# Altium schematic sheet Sheet5.SchDoc
size A3; SPICEModelCacheJPNMEEMH: <root> / <DocumentId>JPNMEEMH</DocumentId> / <CacheFrame Number="0"> / <Model Name="zener" Kind="MDL"> / <Text>*ZENER / *Default Zener 10V @ 10mA / *Zener Diode Pinout: A,K / .MODEL ZENER D( BV=10 IBV=10E-3 )</Text> / </Model> / <Model Name="led0" Kind="MDL"> / <Text>*Typ INFRARED GaAs LED: Vf=1.2V Vr=5V If=40mA trr=3uS / *LED Pinout: 1=A, 2=K / .MODEL LED0 D (IS=93.5P RS=84M N=2.63 BV=5 IBV=10U / + CJO=2.97P VJ=.75 M=.333 TT=4.32U)</Text> / </Model> / </CacheFrame> / </root>
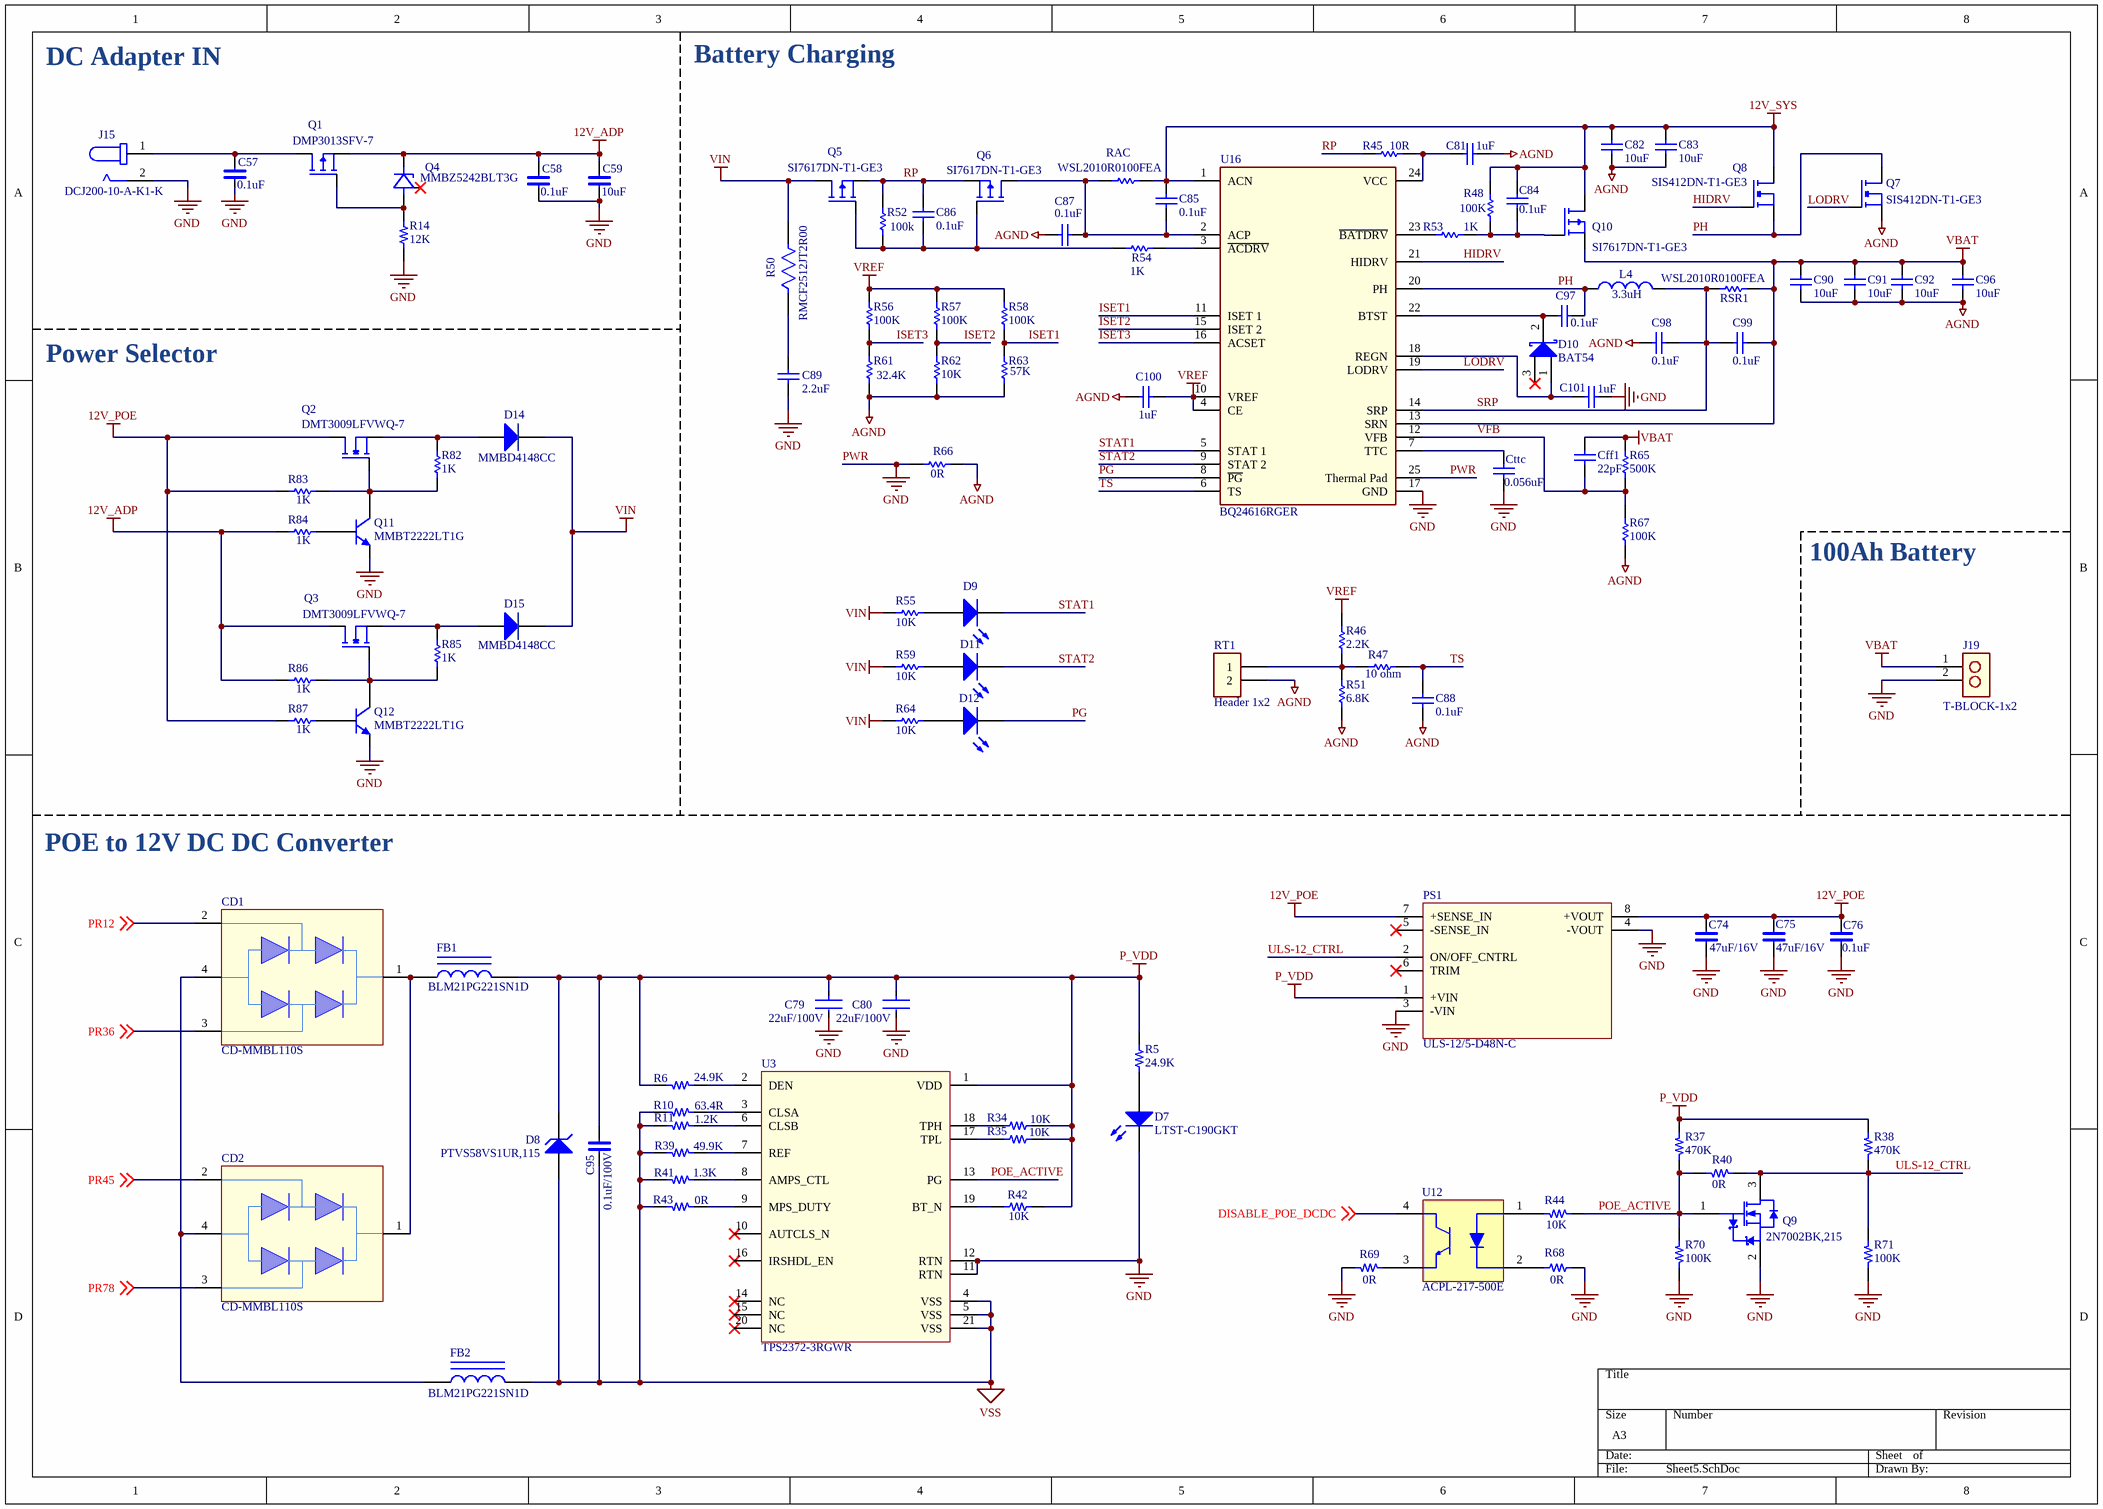
[diagram p0: Sheet5.SchDoc]

## Parts
C57  0.1uF  [C-0603/1608]
C58  0.1uF  [C-0603/1608]
C59  10uF  [C-1206/3216]
C74  47uF/16V  [C-1206/3216]
C75  47uF/16V  [C-1206/3216]
C76  0.1uF  [C-0402/1005]
C79  22uF/100V  [FP-KRM55W-6_1_5_3_6_7_1_2-MFG]
C80  22uF/100V  [FP-KRM55W-6_1_5_3_6_7_1_2-MFG]
C81  value 1uF  [C-0603/1608]  (hidden comment: Capacitor)
C82  value 10uF  [C-0805/2012]  (hidden comment: Capacitor)
C83  value 10uF  [C-0805/2012]  (hidden comment: Capacitor)
C84  value 0.1uF  [R-0402/1005]  (hidden comment: Capacitor)
C85  value 0.1uF  [C-0402/1005]  (hidden comment: Capacitor)
C86  value 0.1uF  [C-0402/1005]  (hidden comment: Capacitor)
C87  value 0.1uF  [C-0402/1005]  (hidden comment: Capacitor)
C88  value 0.1uF  [C-0402/1005]  (hidden comment: Capacitor)
C89  value 2.2uF  [C1206]  (hidden comment: Capacitor)
C90  value 10uF  [C-0805/2012]  (hidden comment: Capacitor)
C91  value 10uF  [C-0805/2012]  (hidden comment: Capacitor)
C92  value 10uF  [C-0805/2012]  (hidden comment: Capacitor)
C95  0.1uF/100V  [C-0402/1005]
C96  value 10uF  [C-0805/2012]  (hidden comment: Capacitor)
C97  value 0.1uF  [C-0402/1005]  (hidden comment: Capacitor)
C98  value 0.1uF  [C-0402/1005]  (hidden comment: Capacitor)
C99  value 0.1uF  [C-0402/1005]  (hidden comment: Capacitor)
C100  value 1uF  [C-0603/1608]  (hidden comment: Capacitor)
C101  value 1uF  [C-0603/1608]  (hidden comment: Capacitor)
CD1  CD-MMBL110S  [CD-MMBL110S]  (value not drawn)
CD2  CD-MMBL110S  [CD-MMBL110S]  (value not drawn)
Cff1  value 22pF  [C-0402/1005]  (hidden comment: Capacitor)
Cttc  value 0.056uF  [C-1206/3216]  (hidden comment: Capacitor)
D7  LTST-C190GKT  [LEDC1608X35N]
D8  PTVS58VS1UR,115  [DIO_PMEG4030ER,115]
D9  LED  [LED-0402-GREEN]  (value not drawn)
D10  BAT54  [SOT-23-3]
D11  LED  [LED-0402-GREEN]  (value not drawn)
D12  LED  [LED-0402-GREEN]  (value not drawn)
D14  MMBD4148CC  [SOT-23-3]
D15  MMBD4148CC  [SOT-23-3]
FB1  BLM21PG221SN1D  [BEADC2012X105N]
FB2  BLM21PG221SN1D  [BEADC2012X105N]
J15  DCJ200-10-A-K1-K  [GCT_DCJ200-10-A-XX-X_REVA]
J19  T-BLOCK-1x2  [Terminal Block-1x2-5.08mm]
L4  value 3.3uH  [IND_SRN6045TA-3R3Y]  (hidden comment: Inductor)
PS1  ULS-12/5-D48N-C  [CONV_ULS-12/5-D48N-C]
Q1  DMP3013SFV-7  [POWERDI3333-8_UX_DIO]
Q2  DMT3009LFVWQ-7  [POWERDI3333-8_UX_DIO]
Q3  DMT3009LFVWQ-7  [POWERDI3333-8_UX_DIO]
Q4  MMBZ5242BLT3G  [SOT-23-3]
Q5  SI7617DN-T1-GE3  [POWERDI3333-8_UX_DIO]
Q6  SI7617DN-T1-GE3  [POWERDI3333-8_UX_DIO]
Q7  SIS412DN-T1-GE3  [POWERDI3333-8_UX_DIO]
Q8  SIS412DN-T1-GE3  [POWERDI3333-8_UX_DIO]
Q9  2N7002BK,215  [NXP-SOT23_M]
Q10  SI7617DN-T1-GE3  [POWERDI3333-8_UX_DIO]
Q11  MMBT2222LT1G  [SOT-23-3]
Q12  MMBT2222LT1G  [SOT-23-3]
R5  24.9K  [R-0402/1005]
R6  24.9K  [R-0402/1005]
R10  63.4R  [R-0402/1005]
R11  1.2K  [R-0402/1005]
R14  12K  [R-0402/1005]
R34  10K  [R-0402/1005]
R35  10K  [R-0402/1005]
R37  470K  [R-0402/1005]
R38  470K  [R-0402/1005]
R39  49.9K  [R-0402/1005]
R40  0R  [R-0402/1005]
R41  1.3K  [R-0402/1005]
R42  10K  [R-0402/1005]
R43  0R  [R-0402/1005]
R44  10K  [R-0402/1005]
R45  value 10R  [R-0805/2012]  (hidden comment: Resistor)
R46  value 2.2K  [R-0402/1005]  (hidden comment: Resistor)
R47  value 10 ohm  [R-0402/1005]  (hidden comment: Resistor)
R48  value 100K  [R-0402/1005]  (hidden comment: Resistor)
R50  RMCF2512JT2R00  [FP-RMCF2512-IPC_A]
R51  value 6.8K  [R-0402/1005]  (hidden comment: Resistor)
R52  value 100k  [R-0402/1005]  (hidden comment: Resistor)
R53  value 1K  [R-0402/1005]  (hidden comment: Resistor)
R54  1K  [R-0402/1005]
R55  value 10K  [R-0402/1005]  (hidden comment: Resistor)
R56  value 100K  [R-0402/1005]  (hidden comment: Resistor)
R57  value 100K  [R-0402/1005]  (hidden comment: Resistor)
R58  value 100K  [R-0402/1005]  (hidden comment: Resistor)
R59  value 10K  [R-0402/1005]  (hidden comment: Resistor)
R61  value 32.4K  [R-0402/1005]  (hidden comment: Resistor)
R62  value 10K  [R-0402/1005]  (hidden comment: Resistor)
R63  value 57K  [R-0402/1005]  (hidden comment: Resistor)
R64  value 10K  [R-0402/1005]  (hidden comment: Resistor)
R65  value 500K  [R-0402/1005]  (hidden comment: Resistor)
R66  value 0R  [R-1210]  (hidden comment: Resistor)
R67  value 100K  [R-0402/1005]  (hidden comment: Resistor)
R68  0R  [R-0402/1005]
R69  0R  [R-0402/1005]
R70  100K  [R-0402/1005]
R71  100K  [R-0402/1005]
R82  1K  [R-0402/1005]
R83  1K  [R-0402/1005]
R84  1K  [R-0402/1005]
R85  1K  [R-0402/1005]
R86  1K  [R-0402/1005]
R87  1K  [R-0402/1005]
RAC  WSL2010R0100FEA  [RESC5125X89X51LL25T25]
RSR1  WSL2010R0100FEA  [RESC5125X89X51LL25T25]
RT1  Header 1x2  [PIN HEADER 1x2 2.54mm]
U3  TPS2372-3RGWR  [QFN65P500X500X100-21N]
U12  ACPL-217-500E  [AVAG-ACPL-217-4_M]
U16  BQ24616RGER  [QFN50P400X400X100-25N]

## Nets
12V_ADP: C58.1 C59.1 Q1.S Q3.D Q4.3 R84.1 R86.1
12V_POE: C74.1 C75.1 C76.1 PS1.7(+SENSE_IN) PS1.8(+VOUT) Q2.D R83.1 R87.1
12V_SYS: C82.1 C83.1 C84.2 C85.2 Q8.D Q10.D R48.2 RAC.2 U16.1(ACN)
AGND: C81.2 C82.2 C83.2 C87.1 C88.1 C90.2 C91.2 C92.2 C96.2 C98.2 C100.1 Q7.S R51.2 R61.2 R62.2 R63.2 R66.1 R67.1 RT1.2
P_VDD: C79.1 C80.1 C95.1 D8.2(K) FB1.2 PS1.1(+VIN) R5.1 R6.2 R34.2 R35.2 R37.1 R38.1 R42.2 U3.1(VDD)
PWR: C57.2 C58.2 C59.2 C74.2 C75.2 C76.2 C79.2 C80.2 C89.1 C101.2 Cttc.2 D7.C J15.2 J19.2 PS1.3(-VIN) PS1.4(-VOUT) Q9.2(S) Q11.1(E) Q12.1(E) R14.1 R66.2 R68.1 R69.1 R70.2 R71.2 U3.11(RTN) U3.12(RTN) U16.17(GND) U16.25(Thermal_Pad)  [also labelled GND]
VBAT: C90.1 C91.1 C92.1 C96.1 C99.1 Cff1.2 J19.1 Q10.S R65.2 RSR1.2 U16.13(SRN)
VIN: D14.2(K) D15.2(K) Q5.D R50.2 R55.2 R59.2 R64.2
VREF: C100.2 R46.1 R56.1 R57.1 R58.1 U16.4(CE) U16.10(VREF)
VSS: C95.2 D8.1(A) FB2.2 R10.2 R11.2 R39.2 R41.2 R43.2 U3.4(VSS) U3.5(VSS) U3.21(VSS)
DISABLE_POE_DCDC: U12.4(COLLECTOR) ; off-sheet DISABLE_POE_DCDC
HIDRV: Q8.G U16.21(HIDRV)
ISET1: R58.2 R63.1 U16.11(ISET_1)
ISET2: R57.2 R62.1 U16.15(ISET_2)
ISET3: R56.2 R61.1 U16.16(ACSET)
LODRV: Q7.G U16.19(LODRV)
PG: D12.2 U16.8(~{PG})
PH: C97.1 L4.1 Q7.D Q8.S U16.20(PH)
POE_ACTIVE: Q9.1(G) R37.2 R40.1 R44.1 R70.1 U3.13(PG)
PR12: CD1.2 ; off-sheet PR12
PR36: CD1.3 ; off-sheet PR36
PR45: CD2.2 ; off-sheet PR45
PR78: CD2.3 ; off-sheet PR78
RP: C86.2 Q5.S Q6.S R45.1 R52.2
SRP: C98.1 C99.2 L4.2 RSR1.1 U16.14(SRP)
STAT1: D9.2 U16.5(STAT_1)
STAT2: D11.2 U16.9(STAT_2)
TS: C88.2 R47.1 U16.6(TS)
ULS-12_CTRL: PS1.2(ON/OFF_CNTRL) Q9.3(D) R38.2 R40.2 R71.1
VFB: Cff1.1 R65.1 R67.2 U16.12(VFB)
NetC57_1: C57.1 J15.1 Q1.D
NetC81_1: C81.1 R45.2 U16.24(VCC)
NetC84_1: C84.1 Q10.G R48.1 R53.1
NetC85_1: C85.1 C87.2 Q6.D RAC.1 U16.2(ACP)
NetC86_1: C86.1 Q5.G Q6.G R52.1 R54.1
NetC89_2: C89.2 R50.1
NetC97_2: C97.2 D10.2 U16.22(BTST)
NetC101_1: C101.1 D10.1 U16.18(REGN)
NetCD1_1: CD1.1 CD2.1 FB1.1
NetCD1_4: CD1.4 CD2.4 FB2.1
NetCttc_1: Cttc.1 U16.7(TTC)
NetD7_A: D7.A R5.2
NetD9_1: D9.1 R55.1
NetD11_1: D11.1 R59.1
NetD12_1: D12.1 R64.1
NetD14_1: D14.1(A) Q2.S R82.2
NetD15_1: D15.1(A) Q3.S R85.2
NetQ1_G: Q1.G Q4.1 R14.2
NetQ2_G: Q2.G Q11.3(C) R82.1 R83.2
NetQ3_G: Q3.G Q12.3(C) R85.1 R86.2
NetQ11_2: Q11.2(B) R84.2
NetQ12_2: Q12.2(B) R87.2
NetR6_1: R6.1 U3.2(DEN)
NetR10_1: R10.1 U3.3(CLSA)
NetR11_1: R11.1 U3.6(CLSB)
NetR34_1: R34.1 U3.18(TPH)
NetR35_1: R35.1 U3.17(TPL)
NetR39_1: R39.1 U3.7(REF)
NetR41_1: R41.1 U3.8(AMPS_CTL)
NetR42_1: R42.1 U3.19(BT_N)
NetR43_1: R43.1 U3.9(MPS_DUTY)
NetR44_2: R44.2 U12.1(ANODE)
NetR46_2: R46.2 R47.2 R51.1 RT1.1
NetR53_2: R53.2 U16.23(~{BATDRV})
NetR54_2: R54.2 U16.3(~{ACDRV})
NetR68_2: R68.2 U12.2(CATHODE)
NetR69_2: R69.2 U12.3(EMITTRE)

Not connected (* = marked no-connect by the designer): D10 3*; PS1 5(-SENSE_IN)* 6(TRIM)*; Q4 2*; U3 10(AUTCLS_N)* 14(NC)* 15(NC)* 16(IRSHDL_EN)* 20(NC)*

## Notes on the sheet
- DC Adapter IN
- Battery Charging
- Power Selector
- 100Ah Battery
- POE to 12V DC DC Converter

## Library data of the parts
C57-C59 = Capacitor-NonPolar: CAP CER 10UF 10V X7R 0805; Mfr. Part No.: GRM21BR71A106KA73K; Unit Price (USD): 0.19; Value: 10uF 10V; Supplier Part No.: 490-14381-1-ND; Supplier: Digikey Electronics
C74-C76 C95 = Capacitor-NonPolar: CAP CER 0.1UF 50V X7R 0402; Mfr. Part No.: UMK105B7104KV-FR; Value: 100nF; Unit Price (USD): 0.15; Supplier Part No.: 587-3498-1-ND; Supplier: Digikey Electronics
C79 C80 = CMP-06035-058120-1: Cap Ceramic 22uF 100V X7R ±15% SMD 2220 +125°C Emboss T/R; Tolerance: 20%; Lead/Base Style: J-Lead; Min Operating Temperature: -55°C; Case/Package: SMD/SMT; Voltage Rating: 100V; Capacitance: 22uF; Mount: Surface Mount; Packaging: Tape and Reel; Max Operating Temperature: 125°C
D7 = LED0: Typical INFRARED GaAs LED; Published: 8-Jun-2000; LatestRevisionDate: 08-Jul-2005; LatestRevisionNote: Mech Layer 1 removed.; PackageReference: LED-0; Publisher: Altium Limited; PackageDescription: LED; 2 Leads
D8 = D Zener: Zener Diode; Published: 8-Jun-2000; LatestRevisionDate: 17-Jul-2002; LatestRevisionNote: Re-released for DXP Platform.; PackageReference: DIODE-0.7; Publisher: Altium Limited; PackageDescription: Diode, Thru-Hole; 2 Leads; 0.7 in Pin Spacing
D9 D11 D12 = LED: Typical INFRARED GaAs LED; Published: 8-Jun-2000; LatestRevisionDate: 08-Jul-2005; LatestRevisionNote: Mech Layer 1 removed.; PackageReference: LED-0; Publisher: Altium Limited; PackageDescription: LED; 2 Leads
D10 = Diode Schottky_1: Schottky Diode; Published: 8-Jun-2000; LatestRevisionDate: 17-Jul-2002; LatestRevisionNote: Re-released for DXP Platform.; PackageReference: SMB; Publisher: Altium Limited; PackageDescription: DO-214-AA/SMB; 2 C-Bend Leads; Body 5.3 x 3.6 mm, inc. leads (LxW); Code_JEDEC: DO-214-AA
D14 D15 = Diode GENERAL: Published: 8-Jun-2000; LatestRevisionDate: 17-Jul-2002; LatestRevisionNote: Re-released for DXP Platform.; PackageReference: SMB; Publisher: Altium Limited; PackageDescription: DO-214-AA/SMB; 2 C-Bend Leads; Body 5.3 x 3.6 mm, inc. leads (LxW); Code_JEDEC: DO-214-AA
FB1 FB2 = Inductor Iron: Magnetic-Core Inductor; Published: 24-Mar-1999; LatestRevisionDate: 17-Jul-2002; LatestRevisionNote: Re-released for DXP Platform.; PackageReference: AXIAL-0.9; Publisher: Altium Limited; PackageDescription: Axial Device, Thru-Hole; 2 Leads; 0.9 in Pin Spacing
J15 = DC Jack: CONN PWR JACK 2X5.5MM SOLDER; Mfr. Part No.: PJ-037AH; Unit Price (USD): 0.71; Supplier Part No.: CP-037AH-ND; Supplier: Digikey Electronics
L4 = Inductor: Code_IEC: 1005; Published: 8-Jun-2000; LatestRevisionDate: 29-May-2009; LatestRevisionNote: IPC-7351 Footprint Added.; PackageReference: 0402-A; Publisher: Altium Limited; PackageDescription: Chip Inductor; Code_JEITA: 0402
PS1 = ULS-12/5-D48N-C: Isolated Module DC DC Converter 1 Output 12V - - 5A 36V - 75V Input; MF: Murata Power Solutions Inc.; Availability: In Stock; SnapEDA_Link: https://www.snapeda.com/parts/ULS-12/5-D48N-C/Murata/view-part/?ref=snap; Purchase-URL: https://pricing.snapeda.com/search/part/ULS-12/5-D48N-C/?ref=eda; Price: None; Check_prices: https://www.snapeda.com/parts/ULS-12/5-D48N-C/Murata/view-part/?ref=eda; Package: None; MP: ULS-12/5-D48N-C; Value: *; ComponentLink1Description: New link; ComponentLink1URL: VOUT-
Q1 Q5 Q6 Q10 = MOSFET-P: Supplier: Digikey Electronics
Q2 Q3 Q7 Q8 = MOSFET-N: Supplier: Digikey Electronics
Q4 = Diode-SOT23-3: Supplier: Digikey Electronics
Q9 = CMP-1259-00083-1: N-Channel Trench MOSFET, 60 V, 0.35 A, -55 to 150 degC, 3-Pin SOT23, Tape and Reel; Manufacturer: NXP Semiconductors; Automotive Qualified: Y; Channel Type: N; ID [max] (A): 0.35; Packing: Tape & Reel; IDM [max] (A): 1.2; VGSth [typ] (V): 1.6; VDS [max] (V): 60; ComponentLink1URL: http://www.nxp.com/; ComponentLink2URL: http://www.nxp.com/documents/data_sheet/2N7002BK.pdf; ComponentLink3Description: Package Specification; PackageVersion: 06-03-16, 03/2006; DatasheetVersion: Rev. 1; PackageReference: SOT23; PartNumber: 2N7002BK,215; Code_JEDEC: TO-236AB; ComponentLink1Description: Manufacturer URL; ComponentLink3URL: http://www.nxp.com/documents/outline_drawing/sot023_po.pdf; ComponentLink2Description: Datasheet; PackageDescription: 3-Pin Small Outline Transistor Package, Body 2.9 x 1.3 mm, Pitch 0.95 mm; Mounting Technology: Surface Mount
Q11 Q12 = 2N3904: NPN General Purpose Amplifier; Published: 8-Jun-2000; LatestRevisionDate: 15-Jan-2003; LatestRevisionNote: PCB Footprint 'BCY-W3/D4.7' replaced; DatasheetVersion: 1997; PackageVersion: Sep-1998; PackageReference: TO-92A; Publisher: Altium Limited; PackageDescription: TO, Flat Index; 3 In-Line, Axial Leads; Body Dia. 4.5mm; Leads 0.51 x 0.48 mm (max); ComponentLink1Description: Manufacturer Link; ComponentLink1URL: http://www.fairchildsemi.com/; ComponentLink2Description: Datasheet; ComponentLink2URL: http://www.fairchildsemi.com/ds/2N%2F2N3904.pdf
R5 R6 R10 R11 R34 R35 R37-R44 R68-R71 = Resistor: RES SMD 15K OHM 1% 1/16W 0402; Mfr. Part No.: MCR01MZPF1502; Value: 15k 1%; Unit Price (USD): 0.1; Supplier Part No.: RHM15.0KLTR-ND; Supplier: Digikey Electronics
R14 = Resistor: RES SMD 51 OHM 0.5% 1/16W 0402; Mfr. Part No.: ERA-2AED510X; Value: 51R; Unit Price (USD): 0.21; Supplier Part No.: P51DECT-ND; Supplier: Digikey Electronics
R45-R48 R51-R53 R55-R59 R61-R67 R82-R87 = Resistor: Semiconductor Resistor; Published: 8-Jun-2000; LatestRevisionDate: 17-Jul-2002; LatestRevisionNote: Re-released for DXP Platform.; PackageReference: AXIAL-0.5; Publisher: Altium Limited; PackageDescription: Axial Device, Thru-Hole; 2 Leads; 0.5 in Pin Spacing
  R82-R87: Value: 1K
R50 = CMP-26527-006700-1: 2Ω ±5% 1W 2512 Thick Film Chip Resistor AEC-Q200 compliant; Temperature Coefficient: 400ppm/°C; Resistance: 2R; Resistor Type: Thick Film; Max Power Dissipation: 1W; Lead Free: Lead Free; Length: 0.248inch; Size Code: 2512; Min Operating Temperature: -55°C; Mount: Surface Mount; Width: 0.126inch; Features: Automotive AEC-Q200; Depth: 3.2mm; Max Operating Temperature: 155°C; Height: 0.028inch; Number of Terminations: 2; Military Standard: Not; Case Code (Imperial): 2512; Case Code (Metric): 6432; Contact Plating: Tin; Power Rating: 1W; Series: RMCF; Construction: Rectangular; Tolerance: 5%; Case/Package: 2512; RoHS Compliant: Yes; Packaging: Tape and Reel; Radiation Hardening: No
R54 = Res1: Resistor; Published: 8-Jun-2000; LatestRevisionDate: 17-Jul-2002; LatestRevisionNote: Re-released for DXP Platform.; PackageReference: AXIAL-0.3; Publisher: Altium Limited; PackageDescription: Axial Device, Thru-Hole; 2 Leads; 0.3 in Pin Spacing; Value: 1K
RAC RSR1 = CMP-2000-07418-1: Chip Resistor, 10 mOhm, +/- 1%, 0.5 W, -65 to 170 degC, 2010 (5025 Metric), RoHS, Tape and Reel; Manufacturer: Vishay; Unit Weight: 0.001372oz; Temperature Coefficient: 75PPM/C; Case Width: 2.5mm; Case Length: 5mm; Resistance: 0.01Ohms; Case Height: 0.635mm; Brand: Vishay/Dale; Power Rating: 500mW(1/2W); Datasheet Version: 07/2016; Package Reference: 2010; Factory Pack Quantity: 4000; Manufacturer URL: http://www.vishay.com/; Series: WSL; Operating Temperature Range: -65Cto+170C; Mounting Technology: SurfaceMount; Package Description: 2-Pin Surface Mount Device, Body 5.08 x 2.54 mm; Product Category: CurrentSenseResistors-SMD; Type: PowerMetalStripResistors,LowValue(downto0.0005Ohms),SurfaceMount; Product: MetalElementCurrentSensingResistors; Datasheet URL: http://www.vishay.com/docs/30100/wsl.pdf; Package / Case: 2010(5025metric); Packaging: Reel; Termination Style: SMD/SMT; Case Code - mm: 5025; Case Code - in: 2010; RoHS: Details; Tradename: PowerMetalStrip; Tolerance: 1%
RT1 = Header 1x2: CONN HEADER VERT 3POS 2.54MM; Mfr. Part No.: 75160-156-03LF; Value: 51R; Unit Price (USD): 0.74; Supplier Part No.: 609-75160-156-03LF-ND; Supplier: Digikey Electronics
U3 = TPS2372-3RGWR: No Description Available; Mfr_Name: Texas Instruments; Type: DEV; RefDes: RefDes; Copyright: Copyright (C) 2023 Ultra Librarian. All rights reserved.; Manufacturer_Part_Number: TPS2372-3RGWR
U12 = CMP-2000-05058-1: DC Input, Half-Pitch Phototransistor Optocoupler, 5 V, -55 to 110 degC, 4-Pin SOIC, RoHS, Tape and Reel; Configuration: 1Channel; Current Transfer Ratio: 600%; Maximum Reverse Diode Voltage: 6V; Maximum Collector Emitter Voltage: 80V; Maximum Rise Time: 2us; Maximum Forward Diode Voltage: 1.4V; Brand: AvagoTechnologies; Output Device: NPNPhototransistor; Maximum Input Diode Current: 50mA; Maximum Fall Time: 3us; Maximum Power Dissipation: 200mW; Isolation Voltage: 3000Vrms; Maximum Collector Emitter Saturation Voltage: 0.4V; Maximum Operating Temperature: +110C; Package Description: 4-Pin Small Outline Integrated Circuits, Body 4.4 x 2.6 mm, Pitch 1.27 mm; Product Category: TransistorOutputOptocouplers; Factory Pack Quantity: 3000; Packaging: Reel; Output Type: DC; Manufacturer URL: http://www.avagotech.com/; Package Reference: SOIC-4; Number of Channels: 1Channel; Datasheet Version: Aug-11; Package / Case: SOIC-4; Maximum Collector Current: 50mA; Datasheet URL: https://datasheet.ciiva.com/15118/getdatasheetpartid-243403-15118938.pdf; Input Type: DC; RoHS: Details; Number of Channels per Chip: 1Channel; Minimum Operating Temperature: -55C; Manufacturer: AvagoTechnologies
U16 = bq24616
C81-C92 C96-C101 Cff1 Cttc = Capacitor: Published: 8-Jun-2000; LatestRevisionDate: 17-Jul-2002; LatestRevisionNote: Re-released for DXP Platform.; PackageReference: RAD-0.3; Publisher: Altium Limited; PackageDescription: Radial Cap, Thru-Hole; 2 Leads; 0.3 in Pin Spacing
J19 = T-BLOCK-1x2: Supplier: Digikey Electronics